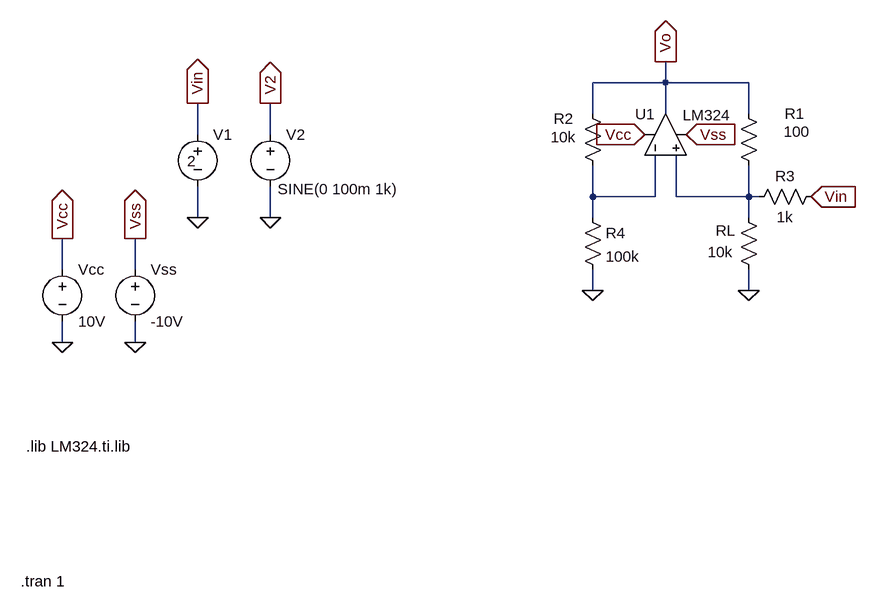
[diagram p0: schematic Circuito2.asc]
Circuito2.asc, the LTspice schematic file:
Version 4.1
SHEET 1 880 680
WIRE 384 -400 384 -432
WIRE 384 -400 272 -400
WIRE 512 -400 384 -400
WIRE 272 -352 272 -400
WIRE 384 -352 384 -400
WIRE 512 -352 512 -400
WIRE -336 -320 -336 -368
WIRE -224 -320 -224 -368
WIRE 272 -224 272 -272
WIRE 368 -224 368 -288
WIRE 368 -224 272 -224
WIRE 400 -224 400 -288
WIRE 512 -224 512 -272
WIRE 512 -224 400 -224
WIRE 528 -224 512 -224
WIRE -336 -192 -336 -240
WIRE -224 -192 -224 -240
WIRE 272 -192 272 -224
WIRE 512 -192 512 -224
WIRE -544 -112 -544 -160
WIRE -432 -112 -432 -160
WIRE 272 -80 272 -112
WIRE 512 -80 512 -112
WIRE -544 0 -544 -32
WIRE -432 0 -432 -32
FLAG 608 -224 Vin
IOPIN 608 -224 In
FLAG 352 -320 Vcc
IOPIN 352 -320 In
FLAG 416 -320 Vss
IOPIN 416 -320 In
FLAG 384 -432 Vo
IOPIN 384 -432 Out
FLAG -544 0 0
FLAG -432 0 0
FLAG -544 -160 Vcc
IOPIN -544 -160 Out
FLAG -432 -160 Vss
IOPIN -432 -160 Out
FLAG -336 -368 Vin
IOPIN -336 -368 Out
FLAG -224 -368 V2
IOPIN -224 -368 Out
FLAG -336 -192 0
FLAG -224 -192 0
FLAG 272 -80 0
FLAG 512 -80 0
SYMBOL OpAmps\\opamp2 320 -320 R270
WINDOW 0 31 17 VRight 2
WINDOW 3 30 90 VRight 2
SYMATTR InstName U1
SYMATTR Value LM324
SYMBOL res 528 -256 R180
WINDOW 0 -70 96 Left 2
WINDOW 3 -78 68 Left 2
SYMATTR InstName R1
SYMATTR Value 100
SYMBOL res 288 -256 R180
WINDOW 0 76 88 Right 2
WINDOW 3 42 60 Left 2
SYMATTR InstName R2
SYMATTR Value 10k
SYMBOL res 512 -208 R270
WINDOW 0 32 56 VTop 2
WINDOW 3 0 56 VBottom 2
SYMATTR InstName R3
SYMATTR Value 1k
SYMBOL res 256 -208 R0
SYMATTR InstName R4
SYMATTR Value 100k
SYMBOL res 528 -96 R180
WINDOW 0 36 76 Left 2
WINDOW 3 40 43 Left 2
SYMATTR InstName RL
SYMATTR Value 10k
SYMBOL voltage -544 -128 R0
SYMATTR InstName Vcc
SYMATTR Value 10V
SYMBOL voltage -432 -128 R0
SYMATTR InstName Vss
SYMATTR Value -10V
SYMBOL voltage -336 -336 R0
WINDOW 3 -16 57 Left 2
WINDOW 123 0 0 Left 0
WINDOW 39 0 0 Left 0
SYMATTR Value 2
SYMATTR InstName V1
SYMBOL voltage -224 -336 R0
WINDOW 3 11 100 Left 2
WINDOW 123 0 0 Left 0
WINDOW 39 0 0 Left 0
SYMATTR Value SINE(0 100m 1k)
SYMATTR InstName V2
TEXT -600 160 Left 2 !.lib LM324.ti.lib
TEXT -608 368 Left 2 !.tran 1

The netlist it stands for:
* Circuito2.asc
X§U1 N002 N001 Vcc Vss Vo LM324  ; pins In+ In- V+ V- OUT
R1 N002 Vo 100
R2 N001 Vo 10k
R3 N002 Vin 1k
R4 N001 0 100k
RL 0 N002 10k
Vcc Vcc 0 10V
Vss Vss 0 -10V
V1 Vin 0 2
V2 V2 0 SINE(0 100m 1k)
.lib LM324.ti.lib
.tran 1
.backanno
.end